# EAGLE design PCB_iter_3 (EAGLE 9.6.2)
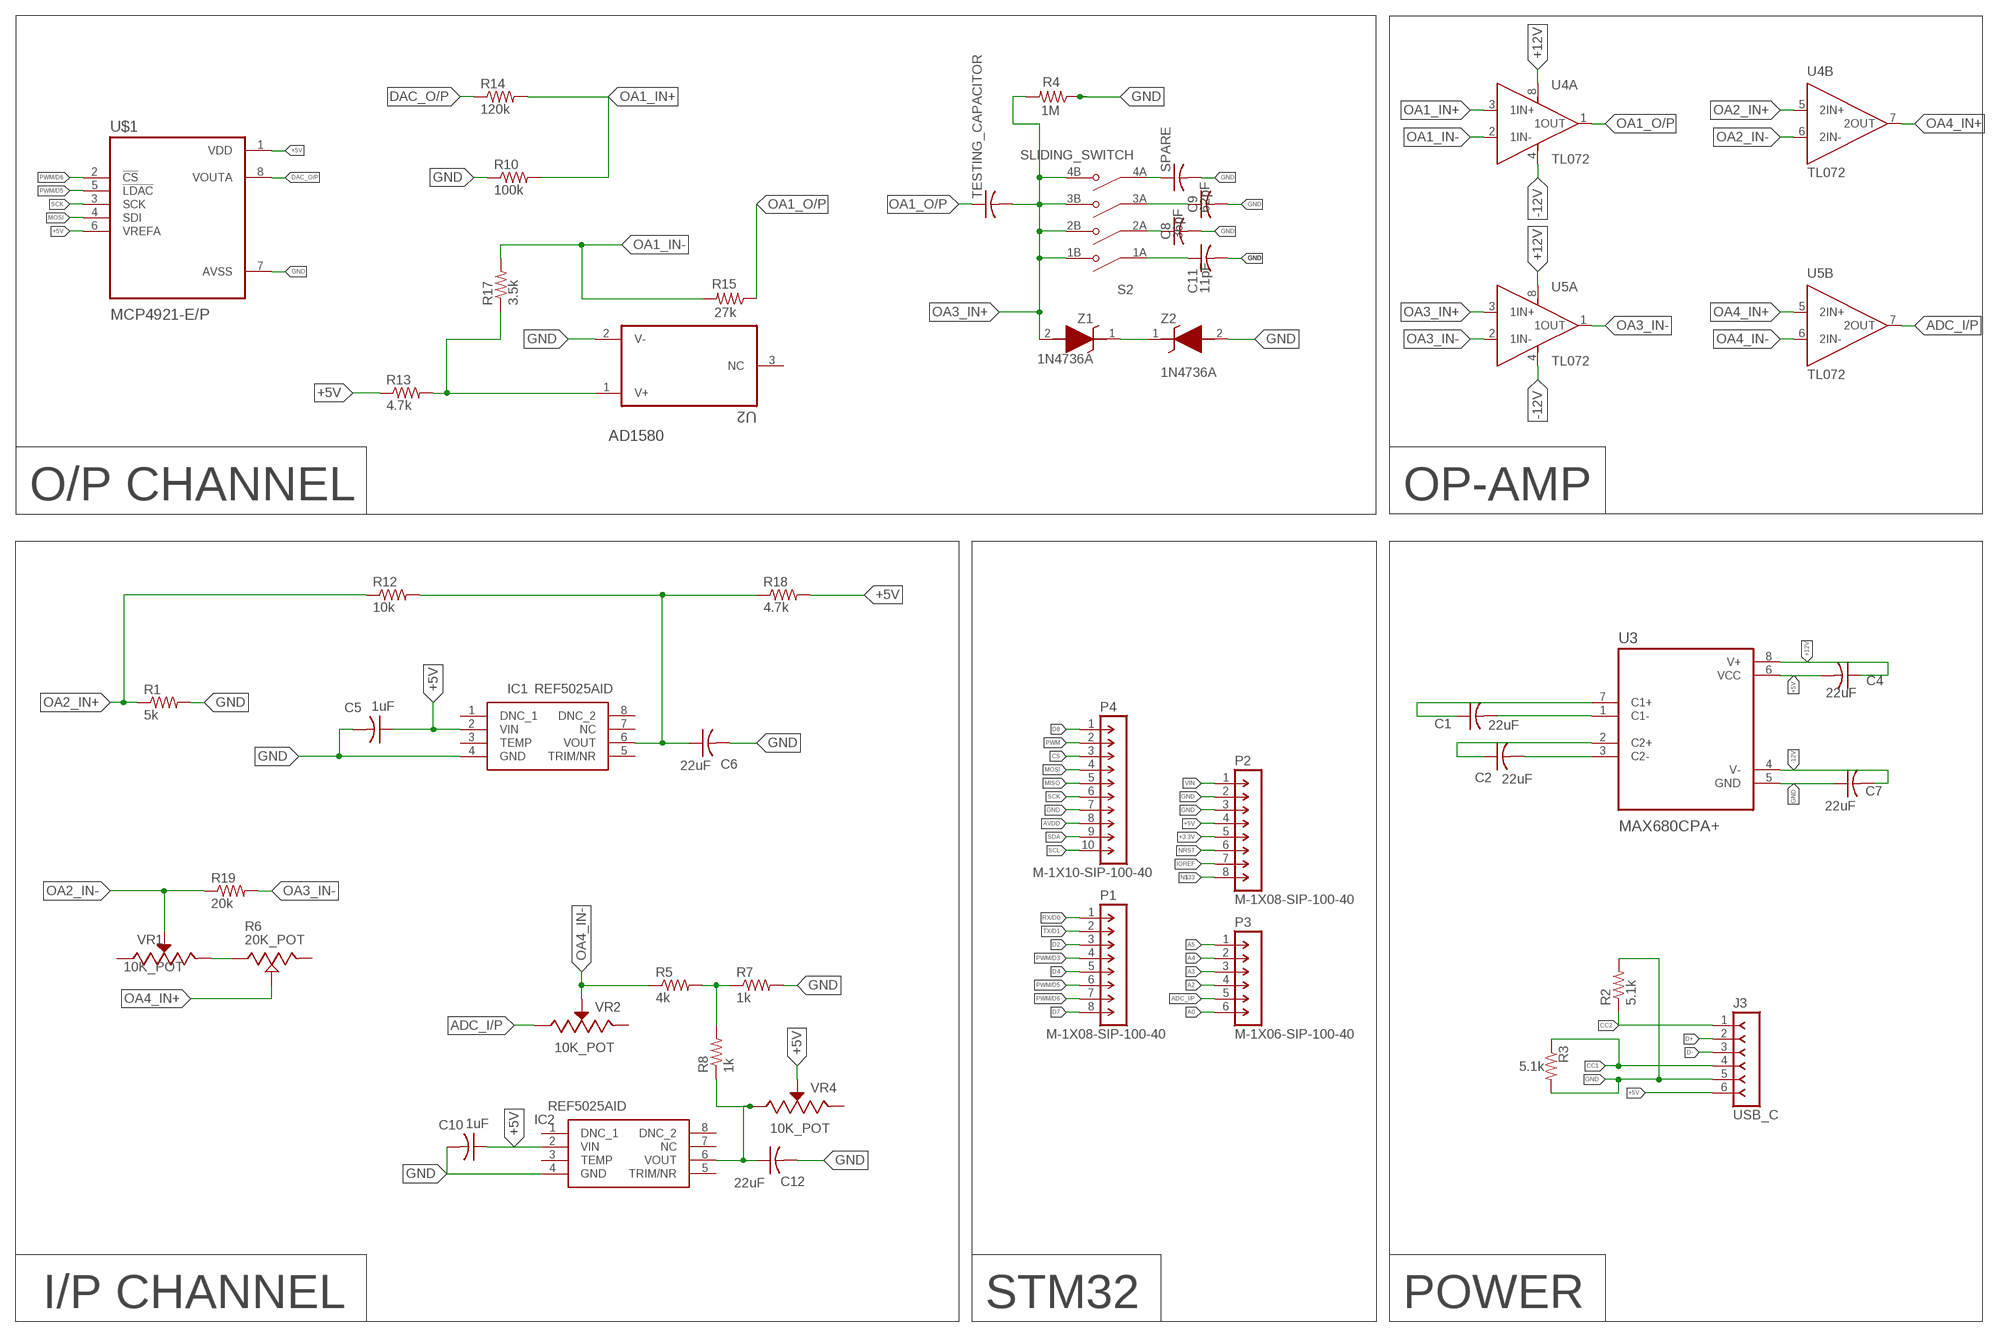
[diagram p0: schematic, sheet 1]

## Parts
C1  22uF  C-USC1206  [C1206]
C2  22uF  C-USC1206  [C1206]
C4  22uF  C-USC1206  [C1206]
C5  1uF  C-USC1206  [C1206]
C6  22uF  C-USC1206  [C1206]
C7  22uF  C-USC1206  [C1206]
C8  36pF  C-USC1206  [C1206]
C9  62pF  C-USC1206  [C1206]
C10  1uF  C-USC1206  [C1206]
C11  11pF  C-USC1206  [C1206]
C12  22uF  C-USC1206  [C1206]
IC1  REF5025AID  [SOIC127P600X175-8N]
IC2  REF5025AID  [SOIC127P600X175-8N]
J3  USB_C  F-1X06-SIP-100-40Y  [SIP-100-06-40Y]
P1  M-1X08-SIP-100-40  [SIP-100-08-40]
P2  M-1X08-SIP-100-40  [SIP-100-08-40]
P3  M-1X06-SIP-100-40  [SIP-100-06-40]
P4  M-1X10-SIP-100-40  [SIP-100-10-40]
R1  5k  R-US_M1206  [M1206]
R2  5.1k  R-US_R1206  [R1206]
R3  5.1k  R-US_R1206  [R1206]
R4  1M  R-US_M1206  [M1206]
R5  4k  R-US_M1206  [M1206]
R6  20K_POT  3296X-1-203LF  [TRIM_3296X-1-203LF]
R7  1k  R-US_M1206  [M1206]
R8  1k  R-US_M1206  [M1206]
R10  100k  R-US_M1206  [M1206]
R12  10k  R-US_M1206  [M1206]
R13  4.7k  R-US_M1206  [M1206]
R14  120k  R-US_M1206  [M1206]
R15  27k  R-US_M1206  [M1206]
R17  3.5k  R-US_M1206  [M1206]
R18  4.7k  R-US_M1206  [M1206]
R19  20k  R-US_M1206  [M1206]
S2  SLIDING_SWITCH  DS01C-254-S-04BE  [SW_DS01C-254-S-04BE]
SPARE  C-USC1206  [C1206]
TESTING_CAPACITOR  C-US050-030X075  [C050-030X075]
U2  AD1580  AD1580BRTZ-R2-REEL7  [SOT96P237X112-3N]
U3  MAX680CPA+  [DIP794W47P254L991H457Q8]
U4  TL072  [DIP794W45P254L1060H508Q8]
U5  TL072  [DIP794W45P254L1060H508Q8]
U$1  MCP4921-E/P  [DIP787W46P254L927H533Q8]
VR1  10K_POT  3296W-1-103RLF  [TRIM_3296W-1-103RLF]
VR2  10K_POT  3296W-1-103RLF  [TRIM_3296W-1-103RLF]
VR4  10K_POT  3296W-1-103RLF  [TRIM_3296W-1-103RLF]
Z1  1N4736A  [DIOAD1413W86L463D238]
Z2  1N4736A  [DIOAD1413W86L463D238]

## Nets
+3.3V: P2.5
+5V: C4.2 C5.1 C10.1 IC1.2(VIN) IC2.2(VIN) J3.6 P2.4 R13.1 R18.2 U3.6(VCC) U$1.1(VDD) U$1.6(VREFA) VR4.2(WIPER)
+12V: C4.1 U3.8(V+) U4.8(A:VCC+) U5.8(A:VCC+)
-12V: C7.2 U3.4(V-) U4.4(A:VCC-) U5.4(A:VCC-)
A0: P3.6
A2: P3.4
A3: P3.3
A4: P3.2
A5: P3.1
ADC_I/P: P3.5 U5.7(B:2OUT) VR2.1(CCW)
AVDD: P4.8
CC1: J3.4 R3.1
CC2: J3.1 R2.1
CS: P4.3
D2: P1.3
D4: P1.5
D7: P1.8
D8: P4.1
D+: J3.2
D-: J3.3
DAC_O/P: R14.1 U$1.8(VOUTA)
GND: C5.2 C6.2 C7.1 C8.2 C9.2 C10.2 C11.2 C12.2 IC1.4(GND) IC2.4(GND) J3.5 P2.2 P2.3 P4.7 R1.2 R2.2 R3.2 R4.1 R7.2 R10.1 SPARE.2 U2.2(V-) U3.5(GND) U$1.7(AVSS) Z2.2(A)
IOREF: P2.7
MISO: P4.5
MOSI: P4.4 U$1.4(SDI)
N$1: R6.1(CCW) VR1.3(CW)
N$2: R5.2 R7.1 R8.2
N$3: C12.1 IC2.6(VOUT) R8.1 VR4.1(CCW)
N$5: C1.2 U3.1(C1-)
N$6: R13.2 R17.1 U2.1(V+)
N$7: C6.1 IC1.6(VOUT) R12.2 R18.1
N$8: Z1.1(K) Z2.1(K)
N$9: C1.1 U3.7(C1+)
N$10: C2.2 U3.3(C2-)
N$11: C2.1 U3.2(C2+)
N$12: C9.1 S2.3A(COM3)
N$13: S2.4A(COM4) SPARE.1
N$14: C11.1 S2.1A(COM1)
N$15: C8.1 S2.2A(COM2)
N$33: P2.8
NRST: P2.6
OA1_IN+: R10.2 R14.2 U4.3(A:1IN+)
OA1_IN-: R15.2 R17.2 U4.2(A:1IN-)
OA1_O/P: R15.1 TESTING_CAPACITOR.1 U4.1(A:1OUT)
OA2_IN+: R1.1 R12.1 U4.5(B:2IN+)
OA2_IN-: R19.1 U4.6(B:2IN-) VR1.2(WIPER)
OA3_IN+: R4.2 S2.1B(NO1) S2.2B(NO2) S2.3B(NO3) S2.4B(NO4) TESTING_CAPACITOR.2 U5.3(A:1IN+) Z1.2(A)
OA3_IN-: R19.2 U5.1(A:1OUT) U5.2(A:1IN-)
OA4_IN+: R6.2(WIPER) U4.7(B:2OUT) U5.5(B:2IN+)
OA4_IN-: R5.1 U5.6(B:2IN-) VR2.2(WIPER)
PWM: P4.2
PWM/D3: P1.4
PWM/D5: P1.6 U$1.5(!LDAC)
PWM/D6: P1.7 U$1.2(!CS)
RX/D0: P1.1
SCK: P4.6 U$1.3(SCK)
SCL: P4.10
SDA: P4.9
TX/D1: P1.2
VIN: P2.1
Unconnected: IC1.1(DNC_1) IC1.3(TEMP) IC1.5(TRIM/NR) IC1.7(NC) IC1.8(DNC_2) IC2.1(DNC_1) IC2.3(TEMP) IC2.5(TRIM/NR) IC2.7(NC) IC2.8(DNC_2) R6.3(CW) U2.3(NC) VR1.1(CCW) VR2.3(CW) VR4.3(CW)

## Notes on the sheet
- O/P CHANNEL | OP-AMP
- I/P CHANNEL | STM32 | POWER

## Library data of the parts
C1 C2 C4-C10 C12 SPARE TESTING_CAPACITOR = adafruit:C-US: CAPACITOR, American symbol
C11 = adafruit:C-US: CAPACITOR, American symbol; SPICEPREFIX: C
IC1 IC2 = REF5025AID:REF5025AID: 3 Vpp/V Noise, 3 ppm/C Drift Precision Series Voltage Reference Source: Datasheet <http://www.ti.com/lit/ds/symlink/ref5025.pdf>; DESCRIPTION: 3 Vpp/V Noise, 3 ppm/C Drift Precision Series Voltage Reference; HEIGHT: 1.75mm; MANUFACTURER_NAME: Texas Instruments; MANUFACTURER_PART_NUMBER: REF5025AID; MOUSER_PART_NUMBER: 595-REF5025AID; MOUSER_PRICE-STOCK: https://www.mouser.co.uk/ProductDetail/Texas-Instruments/REF5025AID?qs=xL7PkI2RoJ6OzMm6G7%2FePw%3D%3D
J3 = con-headers-jp:F-1X06-: FEMALE HEADER
P1 P2 = con-headers-jp:M-1X08-: MALE HEADER
P3 = con-headers-jp:M-1X06-: MALE HEADER
P4 = con-headers-jp:M-1X10-: MALE HEADER
R1-R5 R7 R8 R10 R12-R15 R17-R19 = adafruit:R-US_: RESISTOR, American symbol
R6 = 3296X-1-203LF:3296X-1-203LF: Res Cermet Trimmer 20K Ohm 10% 1/2W 25(Elec)Turn 2.19mm (11.05 X 4.83 X 10.03mm) Pin Thru-Hole Tube Check availability <https://pricing.snapeda.com/parts/3296X-1-203LF/Bourns/view-part?ref=eda>; AVAILABILITY: In Stock; CHECK_PRICES: https://www.snapeda.com/parts/3296X-1-203LF/Bourns/view-part/?ref=eda; DESCRIPTION: Trimmer, Cermet, Rest 20 Kilohms, PCB, 25 Turns, Pwr-Rtg 0.5W | Bourns 3296X-1-203LF; MF: Bourns; MP: 3296X-1-203LF; PACKAGE: SOD-123 Bourns; PRICE: None; PURCHASE-URL: https://www.snapeda.com/api/url_track_click_mouser/?unipart_id=270465&manufacturer=Bourns&part_name=3296X-1-203LF&search_term=None; SNAPEDA_LINK: https://www.snapeda.com/parts/3296X-1-203LF/Bourns/view-part/?ref=snap
S2 = DS01C-254-S-04BE:DS01C-254-S-04BE; MANUFACTURER: CUI; MAXIMUM_PACKAGE_HEIGHT: 7.0mm; PARTREV: 1.0; STANDARD: Manufacturer recommendations
U2 = AD1580BRTZ-R2-REEL7:AD1580BRTZ-R2-REEL7
U3 = MAX680CPA_:MAX680CPA+: None Check availability <https://pricing.snapeda.com/parts/MAX680CPA%2B/Maxim%20Integrated%20Products/view-part?ref=eda>; AVAILABILITY: In Stock; CHECK_PRICES: https://www.snapeda.com/parts/MAX680CPA+/Analog+Devices/view-part/?ref=eda; DESCRIPTION: Charge Pump Switching Regulator IC Positive and Negative (Dual Rail) Fixed ±2Vin 2 Output 10mA 8-DIP (0.300, 7.62mm); MF: Maxim Integrated Products; MP: MAX680CPA+; PACKAGE: None; PRICE: None; SNAPEDA_LINK: https://www.snapeda.com/parts/MAX680CPA+/Analog+Devices/view-part/?ref=snap
U4 U5 = TL072:TL072: Wide Bandwidth Dual JFET Input Operational Amplifier 8-PDIP 0 to 70 Check availability <https://pricing.snapeda.com/parts/TL072/Texas%20Instruments/view-part?ref=eda>; AVAILABILITY: In Stock; CHECK_PRICES: https://www.snapeda.com/parts/TL072/Texas+Instruments/view-part/?ref=eda; DESCRIPTION: Operational Amplifiers - Op Amps Dual Lo-Noise JFET Input Op Amp; MF: Texas Instruments; MP: TL072; PACKAGE: None; PRICE: None; SNAPEDA_LINK: https://www.snapeda.com/parts/TL072/Texas+Instruments/view-part/?ref=snap
U$1 = MCP4921-E_P:MCP4921-E/P; CHECK_PRICES: https://www.snapeda.com/parts/MCP4921-E/P/Microchip/view-part/?ref=eda; DESCRIPTION: Microchip 12 bit Serial DAC 8-Pin PDIP | Microchip Technology Inc. MCP4921-E/P; MF: Microchip; MP: MCP4921-E/P; PACKAGE: DIP-8 Microchip; PURCHASE-URL: https://www.snapeda.com/api/url_track_click_mouser/?unipart_id=60&manufacturer=Microchip&part_name=MCP4921-E/P&search_term=mcp4921; SNAPEDA_LINK: https://www.snapeda.com/parts/MCP4921-E/P/Microchip/view-part/?ref=snap
VR1 VR2 VR4 = 3296W-1-103RLF:3296W-1-103RLF: Res Cermet Trimmer 500K Ohm 10% 0.5W 25(Elec)Turn 2.19mm (9.53 X 4.83 X 11.55mm) Pin Thru-Hole Tube Check availability <https://pricing.snapeda.com/parts/3296W-1-103RLF/Bourns/view-part?ref=eda>; AVAILABILITY: In Stock; CHECK_PRICES: https://www.snapeda.com/parts/3296W-1-103RLF/Bourns/view-part/?ref=eda; DESCRIPTION: Trimmer, Cermet, Rest 10 Kilohms, PCB, 25 Turns, Pwr-Rtg 0.5W | Bourns 3296W-1-103RLF; MF: Bourns; MP: 3296W-1-103RLF; PACKAGE: NON STANDARD-3 Bourns; PRICE: None; PURCHASE-URL: https://www.snapeda.com/api/url_track_click_mouser/?unipart_id=480309&manufacturer=Bourns&part_name=3296W-1-103RLF&search_term=None; SNAPEDA_LINK: https://www.snapeda.com/parts/3296W-1-103RLF/Bourns/view-part/?ref=snap
Z1 Z2 = 1N4736A:1N4736A: 1N4736 - Zener Diode, 6.8V, 5%, 1W Source: Datasheet <https://www.onsemi.com/pdf/datasheet/1n4736at-d.pdf>; DESCRIPTION: 1N4736 - Zener Diode, 6.8V, 5%, 1W; HEIGHT: mm; MANUFACTURER_NAME: onsemi; MANUFACTURER_PART_NUMBER: 1N4736A; MOUSER_PART_NUMBER: 512-1N4736A; MOUSER_PRICE-STOCK: https://www.mouser.co.uk/ProductDetail/onsemi-Fairchild/1N4736A?qs=SSucg2PyLi6CNqBOqJ%2FVZw%3D%3D

## Board
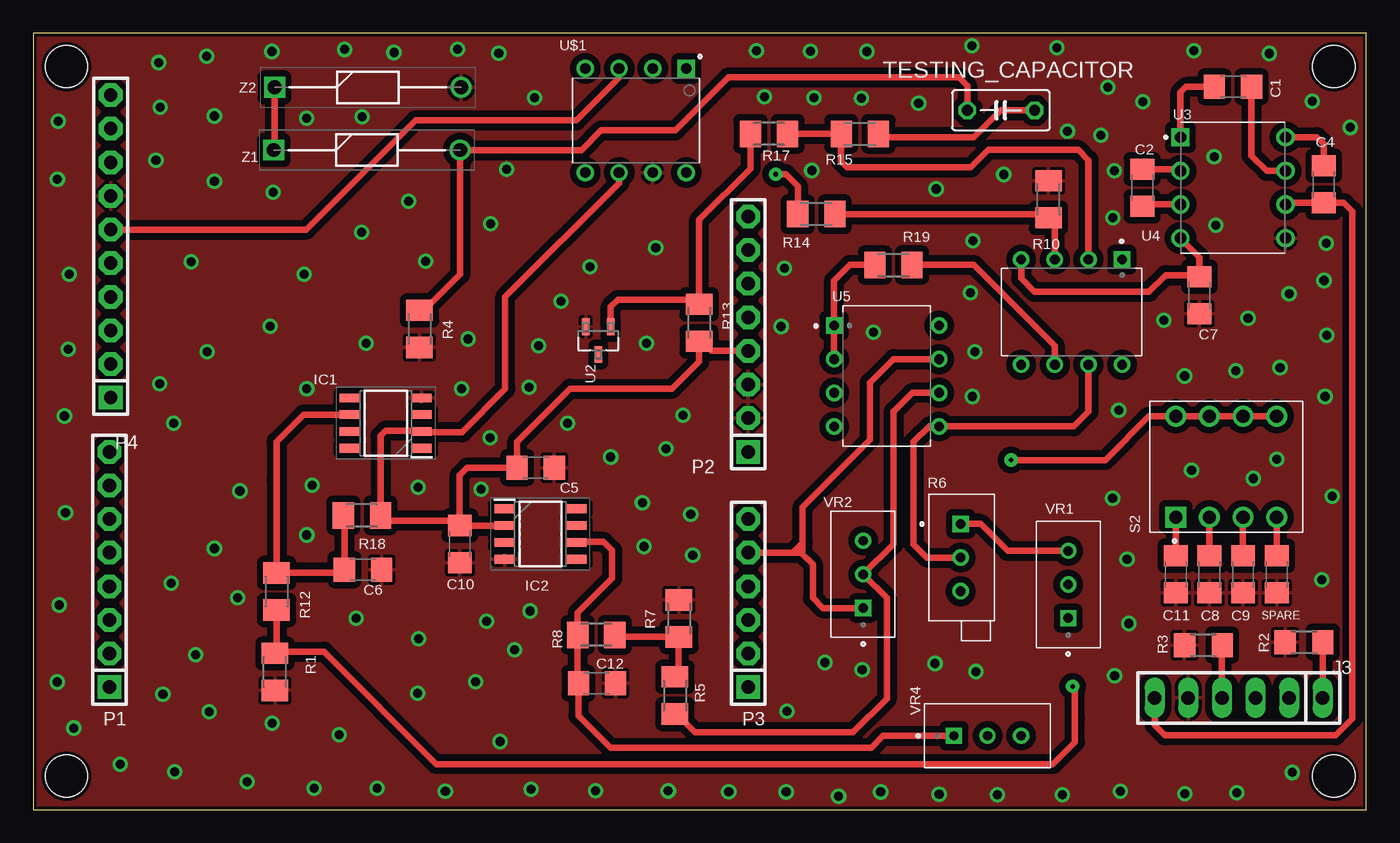
[diagram p1: board, top side]
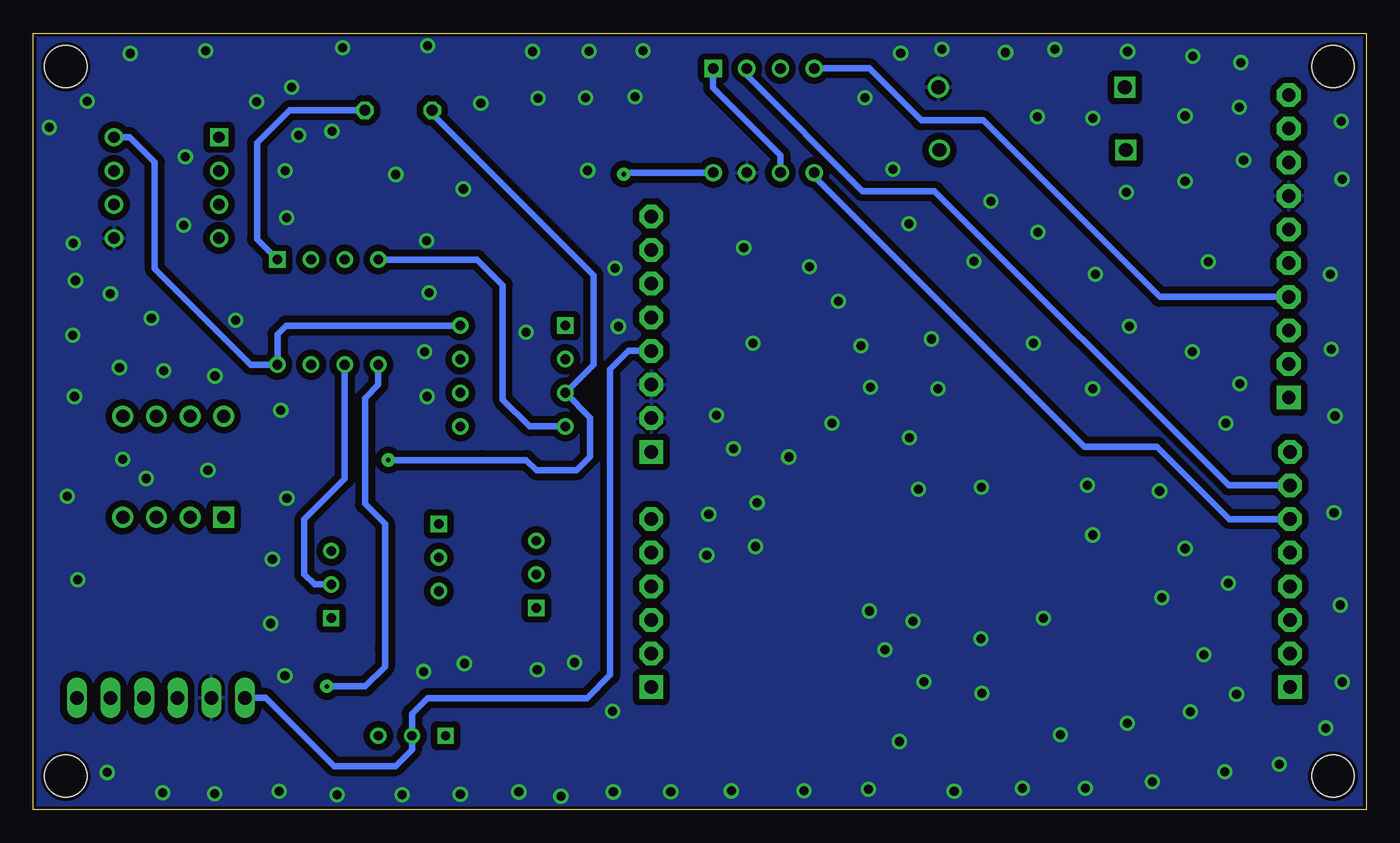
[diagram p2: board, bottom side, seen from below]

Size 100.75 x 58.65 mm. Coordinates in mm from the lower left corner, seen from the top.
Outline: 0,0 100.75,0 100.75,58.65 0,58.65 0,0
Copper layers (1*16): Top 0.035mm / dielectric 1.5mm / Bottom 0.035mm
Design rules "default *": minimum track width 0.5mm, minimum drill 0.35mm, track to track 0.5mm, track to pad 0.5mm, pad to pad 0.5mm, via to via 0.5mm, smd to smd 0.5mm, copper to edge 10mil, drill to drill 6mil, minimum pad ring 10mil, minimum via ring 8mil, stop-mask expansion 4mil, vias tented up to drill 0mil, thermal gap 10mil
Holes 3.2 mm at 2.52,56.12 98.28,56.12 2.52,2.52 98.28,2.52

### Footprints (pad centres in the part's own frame; a part is rotated, then mirrored left to right if it is on the bottom)
C1206 = smd 1.6 x 1.8: 1 -1.4,0; 2 1.4,0
SOIC127P600X175-8N = smd 1.528 x 0.65: 1 -2.711,1.905; 2 -2.711,0.635; 3 -2.711,-0.635; 4 -2.711,-1.905; 5 2.711,-1.905; 6 2.711,-0.635; 7 2.711,0.635; 8 2.711,1.905
SIP-100-06-40Y = drill 1.016 long: 1 -6.35,0; 2 -3.81,0; 3 -1.27,0; 4 1.27,0; 5 3.81,0; 6 6.35,0
SIP-100-08-40 = drill 1.016 pad 1.778 square: 1 -8.89,0 | drill 1.016 pad 1.778 octagon: 2 -6.35,0; 3 -3.81,0; 4 -1.27,0; 5 1.27,0; 6 3.81,0; 7 6.35,0; 8 8.89,0
SIP-100-06-40 = drill 1.016 pad 1.778 square: 1 -6.35,0 | drill 1.016 pad 1.778 octagon: 2 -3.81,0; 3 -1.27,0; 4 1.27,0; 5 3.81,0; 6 6.35,0
SIP-100-10-40 = drill 1.016 pad 1.778 square: 1 -11.43,0 | drill 1.016 pad 1.778 octagon: 2 -8.89,0; 3 -6.35,0; 4 -3.81,0; 5 -1.27,0; 6 1.27,0; 7 3.81,0; 8 6.35,0; 9 8.89,0; 10 11.43,0
M1206 = smd 1.6 x 2: 1 -1.4,0; 2 1.4,0
R1206 = smd 1.6 x 1.803: 1 -1.422,0; 2 1.422,0
TRIM_3296X-1-203LF = drill 0.74 pad 1.14 square: 1 0,2.54 | drill 0.74 pad 1.14: 2 0,0; 3 0,-2.54
SW_DS01C-254-S-04BE = drill 1 pad 1.58 square: 1A -3.81,-3.81 | drill 1 pad 1.58: 1B -3.81,3.81; 2A -1.27,-3.81; 2B -1.27,3.81; 3A 1.27,-3.81; 3B 1.27,3.81; 4A 3.81,-3.81; 4B 3.81,3.81
C050-030X075 = drill 0.813 octagon: 1 -2.54,0; 2 2.54,0
SOT96P237X112-3N = smd 0.559 x 1.27: 1 -0.94,-1.041; 2 0.94,-1.041; 3 0,1.041
DIP794W47P254L991H457Q8 = drill 0.86 pad 1.21 square: 1 -3.97,3.81 | drill 0.86 pad 1.21: 2 -3.97,1.27; 3 -3.97,-1.27; 4 -3.97,-3.81; 5 3.97,-3.81; 6 3.97,-1.27; 7 3.97,1.27; 8 3.97,3.81
DIP794W45P254L1060H508Q8 = drill 0.74 square: 1 -3.97,3.81 | drill 0.74: 2 -3.97,1.27; 3 -3.97,-1.27; 4 -3.97,-3.81; 5 3.97,-3.81; 6 3.97,-1.27; 7 3.97,1.27; 8 3.97,3.81
DIP787W46P254L927H533Q8 = drill 0.8 square: 1 -3.935,3.81 | drill 0.8: 2 -3.935,1.27; 3 -3.935,-1.27; 4 -3.935,-3.81; 5 3.935,-3.81; 6 3.935,-1.27; 7 3.935,1.27; 8 3.935,3.81
TRIM_3296W-1-103RLF = drill 0.71 square: 1 -2.54,0 | drill 0.71: 2 0,0; 3 2.54,0
DIOAD1413W86L463D238 = drill 1.05 pad 1.575 square: 1 0,0 | drill 1.05 pad 1.575: 2 14.1,0

### Placement (x,y rotation side)
C1  90.66,54.59 180 top
C2  83.8,46.97 270 top
C4  97.52,47.23 270 top
C5  37.98,25.83 0 top
C6  24.93,18.12 0 top
C7  88.12,38.85 90 top
C8  88.88,17.76 270 top
C9  91.42,17.76 270 top
C10  32.24,20.05 270 top
C11  86.34,17.76 270 top
C12  42.61,9.53 0 top
IC1  26.65,29.19 180 top
IC2  38.34,20.81 0 top
J3  91.1,8.44 180 top
P1  5.78,18.13 90 top
P2  54.04,35.91 90 top
P3  54.05,15.59 90 top
P4  5.87,42.54 90 top
R1  18.27,10.4 270 top
R2  96.03,12.64 180 top
R3  88.43,12.42 180 top
R4  29.19,36.31 90 top
R5  48.5,8.62 90 top
R6  70.09,19.03 0 top
R7  48.8,14.43 90 top
R8  42.55,13.19 0 top
R10  76.72,46.1 270 top
R12  18.4,16.47 90 top
R13  50.33,36.76 90 top
R14  59.18,44.98 0 top
R15  62.47,51.04 180 top
R17  55.61,51.04 0 top
R18  24.85,22.21 0 top
R19  65.01,41.13 180 top
S2  90.15,25.89 0 top
SPARE  93.96,17.76 270 top
TESTING_CAPACITOR  73.14,52.82 180 top
U2  42.71,35.42 180 top
U3  90.66,46.97 0 top
U4  78.47,37.58 270 top
U5  64.5,32.75 0 top
U$1  45.55,52.04 270 top
VR1  78.22,17 90 top
VR2  62.72,17.76 90 top
VR4  72.12,5.57 0 top
Z1  18.17,49.82 0 top
Z2  18.24,54.55 0 top

### Tracks (layer width: path | path; a pad name or v marks a point on that pad's centre or on a via)
+5V
  Top 0.5: 99.68,6.87 98.41,5.6 85.53,5.6 | U3.6 94.76,45.83 C4.2 99.05,45.83 99.68,45.2 | C10.1 32.24,25.26 32.81,25.83 | C5.1 36.58,27.79 40.57,31.79 48.3,31.79 50.33,33.82 R13.1
  Top 0.508: IC2.2 C10.1 31.89,21.81 26.4,21.81 26.25,21.96 R18.2 26.25,28.23 26.64,28.62 29.3,28.62 IC1.2 29.43,28.5 32.4,28.5 35.67,31.77 35.67,38.72 44.28,47.32 U$1.6 | P2.4 51.24,34.64 50.5,35.38 50.34,35.38 R13.1 | 99.68,45.2 99.68,6.87 | 85.53,5.6 84.75,6.38 J3.6 | C5.1 32.81,25.83
  Bottom 0.508: U$1.1 49.36,54.51 44.28,49.43 U$1.6 | P2.4 55.75,34.64 57.13,33.26 57.13,10.17 58.89,8.42 70.95,8.42 72.12,7.25 VR4.2 72.12,4.53 73.37,3.29 78.02,3.29 83.17,8.44 J3.6
+12V
  Top 0.5: U3.8 97.01,50.78 97.52,50.28 C4.1
  Bottom 0.5: 84.31,33.61 91.55,40.84 91.55,48.88 93.46,50.78
  Bottom 0.508: 84.31,33.61 U4.8 82.28,35.89 81.61,36.56 U5.8 | U3.8 93.46,50.78
-12V
  Top 0.5: U3.4 88.12,41.73 C7.2 88,40.37 85.58,40.37 84.31,39.1 75.68,39.1 74.66,40.12 U4.4
  Bottom 0.5: U5.4 63.23,28.94 65.26,30.97 65.26,39.61 67.2,41.55 U4.4
ADC_I/P
  Top 0.5: 67.71,34.02 65.01,34.02 63.23,32.24 63.23,27.92 58.15,22.84 58.15,20.3 58.15,20.16 | P3.5 57.39,19.4 | 57.39,19.4 58.04,19.4 | 58.04,19.4 58.91,18.53 58.91,15.99 59.67,15.22 VR2.1 | 58.04,19.4 58.15,19.51 58.15,20.16 | 58.15,20.16 57.39,19.4
  Top 0.508: 67.71,34.02 U5.7
CC1
  Top 0.5: J3.4 89.83,12.39 R3.1
CC2
  Top 0.5: J3.1 R2.1
DAC_O/P  (via drill 0.35 pad 1)
  Top 0.508: v56.12,47.99 56.88,47.99 57.78,47.09 R14.1
  Bottom 0.508: v56.12,47.99 56,48.1 U$1.8
GND  (via drill 0.69 pad 1.14)
  other vias: 24.83,43.6 28.38,45.96 20.48,40.45 17.92,36.51 13.14,34.58 2.65,34.76 2.73,40.42 1.84,47.61 1.89,51.98 9.48,56.42 9.28,49.03 13.7,47.46 13.7,52.38 9.56,32.17 11.95,41.39 2.37,29.73 2.45,22.41 1.97,15.45 1.81,9.64 6.59,3.41 3.06,6.16 10.7,2.85 16.19,2.09 21.24,1.61 37.63,1.53 42.5,1.43 47.99,1.41 52.56,1.36 56.91,1.33 60.87,1 64.04,1.33 68.46,1.15 72.86,1.13 77.78,1.13 82.15,1.38 87.03,1.2 90.97,1.28 95.16,2.8 25.99,1.61 31.15,1.38 35.29,5.14 33.44,9.66 36.38,12.07 34.27,14.23 24.42,14.46 29.12,12.91 29.04,8.77 23.12,5.65 13.32,7.4 12.28,11.69 10.45,17.1 13.7,19.72 21.09,24.49 15.63,24.06 10.63,29.17 25.16,35.21 20.69,31.78 32.37,31.78 34.53,28.08 29.09,24.34 33.84,24.19 43.65,26.63 40.37,29.17 49.11,29.78 46.03,23.17 49.69,22.31 38.19,35.04 46.34,35.21 47.05,42.43 42.07,41.01 34.58,44.26 29.65,41.41 35.77,48.37 37.88,53.76 35.19,57.13 32.06,57.44 27.26,57.18 23.53,57.41 18.04,57.26 13.12,56.91 20.66,52.21 24.85,52.33 54.67,57.31 58.73,57.29 63,57.26 87.72,57.31 83.85,53.48 81.21,54.57 73.34,47.96 68.23,46.87 71,42.96 58.84,48.27 85.43,36.97 94.9,38.97 97.72,42.78 97.75,35.82 94.22,33.38 93.96,26.45 87.54,25.64 81.57,23.5 82.03,30.16 70.98,31.2 71.15,34.58 70.82,39.05 82.66,18.91 82.79,14.06 81.72,10.12 71.23,10.42 68.16,11.03 62.65,10.55 59.83,11.11 56.96,7.43 97.37,17.36 98.16,23.66 97.62,31.2 90.89,33.13 87,32.75 89.37,44.13 89.24,49.31 96.66,53.5 99.53,51.52 93.41,57.11 81.59,44.71 81.7,48.24 77.35,57.54 70.93,57.69 56.52,36.48 56.78,40.88 63.51,36.05 9.61,53.04 18.15,46.62 47.84,27.26 20.69,20.74 18.07,6.51 15.45,16.01 9.81,8.72 39.89,38.39 37.55,15 46.16,19.87 49.84,19.21 37.47,31.89 32.88,35.54 59.01,53.76 55.25,53.83 62.59,53.73 66.91,53.35 80.68,50.94 78.17,51.24 91.81,37.12 97.55,39.96 92.21,25
  pour Top: 102.02,59.6 102.02,-0.46 -0.98,-0.46 -0.98,59.6
  pour Bottom: -2.56,61.2 -2.56,-1.79 -2.81,-2.05 102.6,-2.05 102.85,-1.79 102.85,61.45 -2.3,61.45
MOSI
  Bottom 0.508: P4.4 15.62,38.73 28.94,52.05 33.62,52.05 37.55,55.98 U$1.4
N$1
  Top 0.508: VR1.3 73.64,19.54 71.61,21.57 R6.1
N$2
  Top 0.508: R8.2 44.11,13.03 R7.1 48.75,13.03 48.75,10.27 R5.2
N$3
  Top 0.508: IC2.6 41.09,20.21 43.12,20.21 43.75,19.58 43.75,17.45 41.15,14.86 R8.1 41.15,9.59 C12.1 41.2,7.1 43.62,4.68 63.33,4.68 64.22,5.57 VR4.1
N$5
  Top 0.5: U3.1 86.69,54.18 87.11,54.59 C1.2
N$6
  Top 0.5: R17.1 54.21,48.42
  Top 0.508: U2.1 43.65,37.96 44.18,38.49 50,38.49 R13.2 50.33,44.54 54.21,48.42
N$7
  Top 0.5: IC1.6 20.43,29.83 18.4,27.79 18.4,24.93
  Top 0.508: 18.4,24.93 R12.2 23.27,17.87 C6.1 23.53,22.11 23.54,22.12 R18.1
N$8
  Top 0.508: Z2.1 18.24,49.88 Z1.1
N$9
  Top 0.5: C1.1 92.06,49.38 93.2,48.24 U3.7
N$10
  Top 0.508: U3.3 83.93,45.7 C2.2
N$11
  Top 0.508: U3.2 86.56,48.37 C2.1
N$12
  Top 0.508: S2.3A C9.1
N$13
  Top 0.508: S2.4A SPARE.1
N$14
  Top 0.508: S2.1A C11.1
N$15
  Top 0.5: S2.2A C8.1
OA1_IN+
  Top 0.5: U4.3 77.2,44.22 R10.2 | R10.2 76.44,44.98 R14.2 | R10.2 77.09,44.33
OA1_IN-
  Top 0.5: 70.88,48.5 72.2,49.82 78.98,49.82 79.74,49.06 U4.2
  Top 0.508: R17.2 R15.2 61.07,50.07 61.04,50.05 61.04,48.96 61.51,48.5 70.88,48.5
OA1_O/P
  Top 0.508: R15.1 64.12,50.78 71.1,50.78 73.14,52.82 TESTING_CAPACITOR.1
  Bottom 0.508: U4.1 83.83,43.09 83.83,50.36 81.37,52.82 TESTING_CAPACITOR.1
OA2_IN+  (via drill 0.35 pad 1)
  Top 0.5: 78.72,6.84 78.72,9.13 v78.55,9.31 | 30.46,3.44 21.98,11.92 18.4,11.92 R12.1
  Top 0.508: R1.1 18.4,11.92 | 78.72,6.84 78.72,5.09 77.07,3.44 30.46,3.44
  Bottom 0.5: 74.15,12.18 74.15,10.8 75.65,9.31 v78.55,9.31
  Bottom 0.508: U4.5 74.66,32.08 75.68,31.07 75.68,23.1 74.15,21.57 74.15,12.18
OA2_IN-
  Top 0.5: R19.1 71.1,41.13 77.2,35.04 U4.6
  Bottom 0.508: U4.6 77.2,24.97 80.25,21.92 80.25,17.76 79.49,17 VR1.2
OA3_IN+  (via drill 0.35 pad 1)
  Top 0.508: S2.4B S2.3B S2.2B S2.1B 84.31,29.7 81.01,26.4 v73.9,26.4 | R4.2 29.55,37.71 32.27,40.43 Z1.2 41.43,49.82 42.92,51.3 48.53,51.3 52.54,55.3 69.96,55.3 70.6,54.67 TESTING_CAPACITOR.2
  Bottom 0.5: TESTING_CAPACITOR.2 70.6,52.56 58.4,40.37 58.4,33.61 U5.3 58.66,29.61 58.66,26.65 59.67,25.64 62.72,25.64 63.48,26.4 66.79,26.4
  Bottom 0.508: v73.9,26.4 66.79,26.4
OA3_IN-
  Top 0.5: U5.2 U5.1 60.53,39.96 61.71,41.13 R19.2
OA4_IN+
  Top 0.508: R6.2 67.55,19.03 66.53,20.05 66.53,27.76 67.71,28.94 U5.5 78.63,28.94 79.74,30.05 U4.7
OA4_IN-
  Top 0.508: U5.6 66.44,31.48 65.01,30.05 65.01,20.05 VR2.2 64.5,15.99 64.5,8.37 61.96,5.83 50.02,5.83 48.63,7.22 R5.1
PWM/D5
  Bottom 0.508: P1.6 10.35,21.94 15.82,27.42 21.32,27.42 41.74,47.83 U$1.5
PWM/D6
  Bottom 0.508: P1.7 10.39,24.48 32.63,46.72 38.08,46.72 46.82,55.45 U$1.2
SCK
  Top 0.508: P4.6 20.65,43.81 28.89,52.05 41.06,52.05 44.28,55.27 U$1.3